# EAGLE design 20190608_ORIGAMI_V2-H-08slot-fixed (EAGLE 9.4.2)
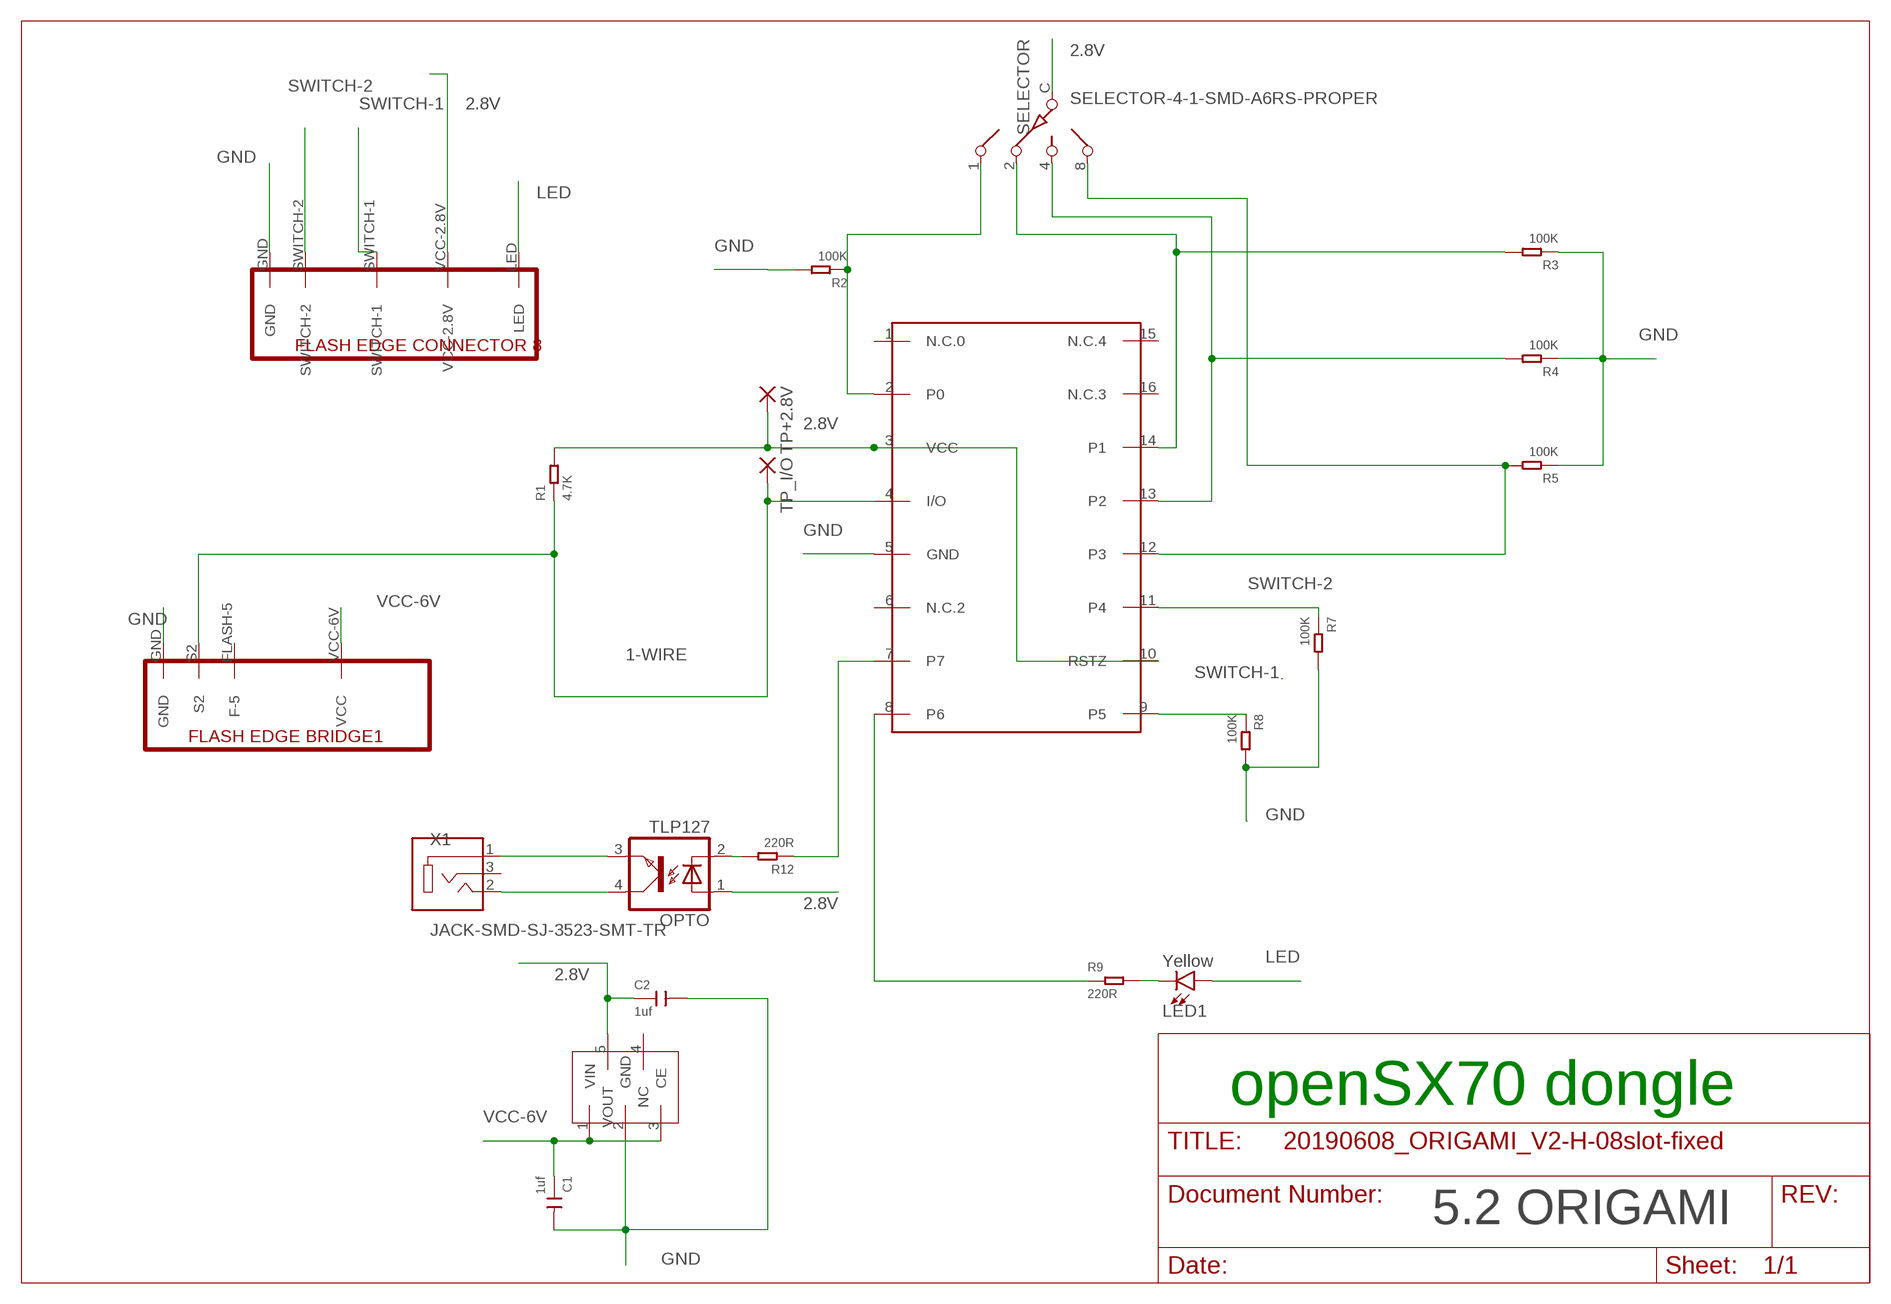
[diagram p0: schematic, sheet 1]

## Parts
C1  1uf  CERAMIC-1UF-25V-10%-X7R(0603)  [C0603]
C2  1uf  CERAMIC-1UF-25V-10%-X7R(0603)  [C0603]
DS2408  DS2408  [SO16]
LED1  Yellow  LED-YELLOWLILYPAD  [LED-1206]
OPTO  TLP127  [SO-4]
R1  4.7K  SMD-RES-4.7K-5%-1/10W(0603)  [R0603]
R2  100K  SMD-RES-100K-1%-1/10W(0603)  [R0603]
R3  100K  SMD-RES-100K-1%-1/10W(0603)  [R0603]
R4  100K  SMD-RES-100K-1%-1/10W(0603)  [R0603]
R5  100K  SMD-RES-100K-1%-1/10W(0603)  [R0603]
R7  100K  SMD-RES-100K-1%-1/10W(0603)  [R0603]
R8  100K  SMD-RES-100K-1%-1/10W(0603)  [R0603]
R9  220R  SMD-RES-220R-5%-1/10W(0603)  [R0603]
R12  220R  SMD-RES-220R-5%-1/10W(0603)  [R0603]
REG  NCP4688  [SOT-23-5]
SELECTOR  SELECTOR-4-1-SMD-A6RS-PROPER  [A6RS-161RS]
TP+2.8V  SMD2  [SMD1,27-2,54]
TP_I/O  SMD2  [SMD1,27-2,54]
U$1  FLASH-BRIDGE-SW1-SW2-LED  [FLASH-8-BRIDGE-SW1-SW2-LED]
U$2  FLASH-BRIDGE1  [FLASH-8-BRIDGE1]
X1  JACK-SMD-SJ-3523-SMT-TR  [CUI_SJ-3523-SMT-TR]

## Nets
1-WIRE: DS2408.4(I/O) R1.1 TP_I/O.1(P) U$2.S2
2.8V: C2.1 DS2408.3(VCC) DS2408.10(RSTZ) OPTO.1(A) R1.2 REG.5(VOUT) SELECTOR.C TP+2.8V.1(P) U$1.VCC-2.8V
GND: C1.2 C2.2 DS2408.5(GND) R2.2 R3.1 R4.1 R5.1 R7.2 R8.2 REG.2(GND) U$1.GND U$2.GND
LED: LED1.A U$1.LED
N$1: OPTO.3(EMIT) X1.1
N$2: LED1.C R9.2
N$3: DS2408.2(P0) R2.1 SELECTOR.1
N$4: DS2408.14(P1) R3.2 SELECTOR.2
N$5: DS2408.13(P2) R4.2 SELECTOR.4
N$6: OPTO.4(COL) X1.2
N$7: DS2408.8(P6) R9.1
N$10: OPTO.2(C) R12.2
N$11: DS2408.7 R12.1
N$13: DS2408.12(P3) R5.2 SELECTOR.8
SWITCH-1: DS2408.9(P5) R8.1 U$1.SWITCH-1
SWITCH-2: DS2408.11(P4) R7.1 U$1.SWITCH-2
VCC-6V: C1.1 REG.1(VIN) REG.3(CE) U$2.VCC-6V(VCC)
Unconnected: DS2408.1(N.C.0) DS2408.6(N.C.2) DS2408.15(N.C.4) DS2408.16(N.C.3) REG.4(NC) U$2.FLASH-5(F-5) X1.3

## Notes on the sheet
- openSX70 dongle
- 5.2 ORIGAMI

## Library data of the parts
C1 C2 = Seeed-Capacitor:CERAMIC-1UF-25V-10%-X7R(0603): 302010139; MPN: CC0603KRX7R8BB105
DS2408 = _openSX70:DS2408
LED1 = SparkFun-LED:LED-YELLOW: Yellow SMD LED Used in manufacturing several products at SparkFun. Packages: 0603 - SMD 0603 package[Product Link] <http://www.kingbrightusa.com/product.asp?catalog_name=LED&product_id=APT1608SYCK> 0603 -SMART - SMART SMD 0603 package (more efficient/more expensive) [Product Link] <http://www.osram-os.com/osram_os/en/products/product-catalog/led-light-emitting-diodes/smartled-0603/ly-l29k/index.jsp> LilyPad - SMD1206 package[Product Datasheet] <https://www.sparkfun.com/datasheets/DevTools/LilyPad/Q150YUS4.pdf> SparkFun Products: Blynk Board <https://www.sparkfun.com/products/13794> IOIO-OTG <https://www.sparkfun.com/products/13613> XBee Explorer Serial <https://www.sparkfun.com/products/13225>; PROD_ID: DIO-09909
OPTO = _openSX70:TLP127
R1 = Seeed-Resistor:SMD-RES-4.7K-5%-1/10W(0603): 301010290; MPN: RC0603JR-074K7L
R2-R5 R7 R8 = Seeed-Resistor:SMD-RES-100K-1%-1/10W(0603): 301010196; MPN: RC0603FR-07100KL
R9 R12 = Seeed-Resistor:SMD-RES-220R-5%-1/10W(0603): 301010163; MPN: RC0603JR-07220RL
REG = openSX70:NCP4688
SELECTOR = _openSX70:SELECTOR-4-1-SMD-A6RS-PROPER
TP+2.8V TP_I/O = wirepad:SMD2: SMD PAD
U$1 = _openSX70:FLASH-BRIDGE-SW1-SW2-LED
U$2 = _openSX70:FLASH-BRIDGE1
X1 = _openSX70:JACK-SMD-SJ-3523-SMT-TR: Audio Jack Connector 3.5 mm Low Profile Surface Mount Stereo Jack, 3 Pin Right-Angle; AVAILABILITY: Unavailable; CUI_PURCHASE_URL: https://www.cui.com/product/interconnect/audio-connectors/3.5-mm-jacks/sj-352x-smt-series?utm_source=snapeda.com&utm_medium=referral&utm_campaign=snapedaBOM; DESCRIPTION: SJ Series 3.5 mm 12 V SMT Right Angle Stereo Audio Jack; MF: CUI Inc.; MP: SJ-3523-SMT-TR; PACKAGE: LGA-10 STMicroelectronics; PRICE: None

## Net classes
0 GND: width 0.305 mm
1 VCC: width 0.254 mm
2 2.8V: width 0.254 mm

## Board
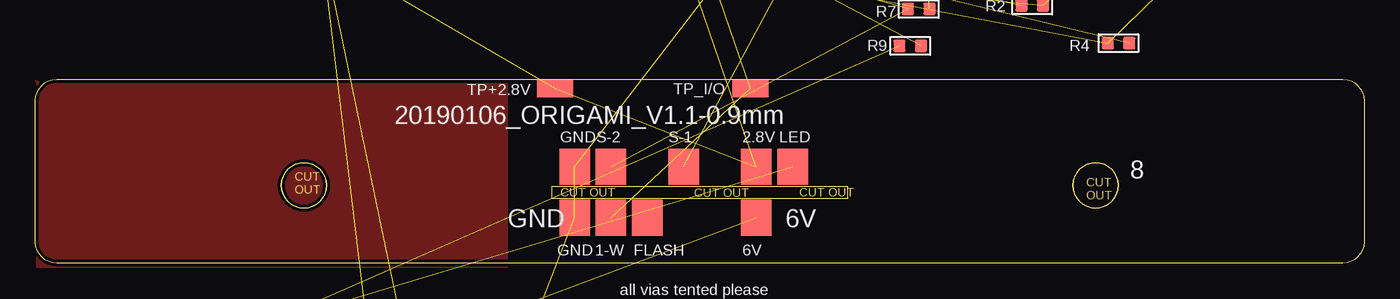
[diagram p1: board, top side]
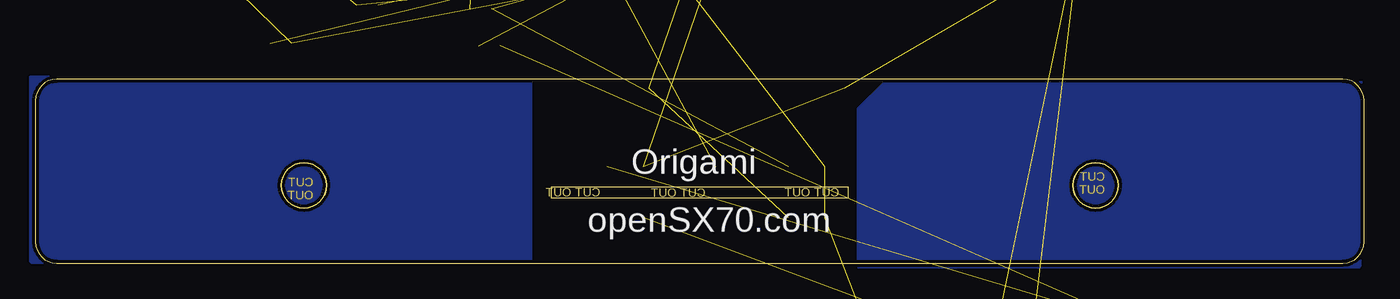
[diagram p2: board, bottom side, seen from below]

Size 94 x 13 mm. Coordinates in mm from the lower left corner, seen from the top.
Outline: 75,7.11 75.32,7.07 75.62,6.98 75.9,6.83 76.14,6.64
Outline: 76.14,6.64 76.33,6.4 76.48,6.13 76.57,5.82 76.61,5.5
Outline: 76.61,5.5 76.57,5.18 76.48,4.88 76.33,4.6 76.14,4.37
Outline: 76.14,4.37 75.9,4.17 75.62,4.02 75.32,3.93 75,3.9
Outline: 75,3.9 74.68,3.93 74.38,4.02 74.1,4.17 73.87,4.37
Outline: 73.87,4.37 73.67,4.6 73.52,4.88 73.43,5.18 73.4,5.5
Outline: 73.4,5.5 73.43,5.82 73.52,6.13 73.67,6.4 73.87,6.64
Outline: 73.87,6.64 74.1,6.83 74.38,6.98 74.68,7.07 75,7.11
Outline: 19,7.11 19.32,7.07 19.62,6.98 19.9,6.83 20.14,6.64
Outline: 20.14,6.64 20.33,6.4 20.48,6.13 20.57,5.82 20.61,5.5
Outline: 20.61,5.5 20.57,5.18 20.48,4.88 20.33,4.6 20.14,4.37
Outline: 20.14,4.37 19.9,4.17 19.62,4.02 19.32,3.93 19,3.9
Outline: 19,3.9 18.68,3.93 18.38,4.02 18.1,4.17 17.87,4.37
Outline: 17.87,4.37 17.67,4.6 17.52,4.88 17.43,5.18 17.4,5.5
Outline: 17.4,5.5 17.43,5.82 17.52,6.13 17.67,6.4 17.87,6.64
Outline: 17.87,6.64 18.1,6.83 18.38,6.98 18.68,7.07 19,7.11
Outline: 75,7.11 74.69,7.07 74.39,6.98 74.11,6.83 73.87,6.64
Outline: 73.87,6.64 73.67,6.39 73.52,6.11 73.43,5.81 73.4,5.5
Outline: 73.4,5.5 73.43,5.19 73.52,4.89 73.67,4.61 73.87,4.37
Outline: 73.87,4.37 74.11,4.17 74.39,4.02 74.69,3.93 75,3.9
Outline: 75,3.9 75.31,3.93 75.61,4.02 75.89,4.17 76.14,4.37
Outline: 76.14,4.37 76.33,4.61 76.48,4.89 76.57,5.19 76.61,5.5
Outline: 76.61,5.5 76.57,5.81 76.48,6.11 76.33,6.39 76.14,6.64
Outline: 76.14,6.64 75.89,6.83 75.61,6.98 75.31,7.07 75,7.11
Outline: 19,7.11 18.69,7.07 18.39,6.98 18.11,6.83 17.87,6.64
Outline: 17.87,6.64 17.67,6.39 17.52,6.11 17.43,5.81 17.4,5.5
Outline: 17.4,5.5 17.43,5.19 17.52,4.89 17.67,4.61 17.87,4.37
Outline: 17.87,4.37 18.11,4.17 18.39,4.02 18.69,3.93 19,3.9
Outline: 19,3.9 19.31,3.93 19.61,4.02 19.89,4.17 20.14,4.37
Outline: 20.14,4.37 20.33,4.61 20.48,4.89 20.57,5.19 20.61,5.5
Outline: 20.61,5.5 20.57,5.81 20.48,6.11 20.33,6.39 20.14,6.64
Outline: 20.14,6.64 19.89,6.83 19.61,6.98 19.31,7.07 19,7.11
Outline: 1.51,13 92.49,13 92.8,12.97 93.08,12.88 93.33,12.74 93.56,12.56 93.74,12.33 93.88,12.08 93.97,11.8 94,11.49 94,1.51 93.97,1.2 93.88,0.92 93.74,0.67 93.56,0.44 93.33,0.26 93.08,0.12 92.8,0.03 92.49,0 1.51,0 1.2,0.03 0.92,0.12 0.67,0.26 0.44,0.44 0.26,0.67 0.12,0.92 0.03,1.2 0,1.51 0,11.49 0.03,11.8 0.12,12.08 0.26,12.33 0.44,12.56 0.67,12.74 0.92,12.88 1.2,12.97 1.51,13
Outline: 36.5,4.61 57.5,4.61 57.5,5.41 36.5,5.41 36.5,4.61
Copper layers (1*16): Top 0.035mm / dielectric 1.5mm / Bottom 0.035mm
Design rules "SeeedStudio_2layer_DRU_no_angle_20140221": minimum track width 6mil, minimum drill 12mil, track to track 6mil, track to pad 6mil, pad to pad 6mil, via to via 6mil, smd to smd 0mil, copper to edge 10mil, drill to drill 10mil, minimum pad ring 10mil, minimum via ring 6mil, stop-mask expansion 2mil, vias tented up to drill 100mil, thermal gap 10mil

### Footprints (pad centres in the part's own frame; a part is rotated, then mirrored left to right if it is on the bottom)
C0603 = smd 0.889 x 0.889: 1 0,0.762; 2 0,-0.762
SO16 = smd 0.66 x 2.032: 1 -4.445,-3.073; 2 -3.175,-3.073; 3 -1.905,-3.073; 4 -0.635,-3.073; 5 0.635,-3.073; 6 1.905,-3.073; 7 3.175,-3.073; 8 4.445,-3.073; 9 4.445,3.073; 10 3.175,3.073; 11 1.905,3.073; 12 0.635,3.073; 13 -0.635,3.073; 14 -1.905,3.073; 15 -3.175,3.073; 16 -4.445,3.073
LED-1206 = smd 1.2 x 1.4: A -1.5,0; C 1.5,0
SO-4 = smd 1 x 0.6: 1 -3.24,0.635; 2 -3.24,-1.905; 3 3.24,-1.905; 4 3.24,0.635
R0603 = smd 0.889 x 0.889: 1 0,0.762; 2 0,-0.762
SOT-23-5 = smd 0.69 x 1.2: 1 -0.95,-1.3; 2 0,-1.3; 3 0.95,-1.3; 4 0.95,1.3; 5 -0.95,1.3
A6RS-161RS = smd 1 x 2.7: 1 8.89,-1.397; 2 6.35,-1.397; 4 3.81,-1.397; 8 1.27,-1.397; C 6.35,11.303
SMD1,27-2,54 = smd 1.27 x 2.54: 1 0,0
FLASH-8-BRIDGE-SW1-SW2-LED = smd 2.159 x 2.54: GND -9,7.5; LED 6.42,7.5; SWITCH-1 -1.29,7.5; SWITCH-2 -6.43,7.5; VCC-2.8V 3.85,7.5
FLASH-8-BRIDGE1 = smd 2.159 x 2.54: FLASH-5 -3.86,7.5; GND -9,7.5; S2 -6.43,7.5; VCC-6V 3.85,7.5
CUI_SJ-3523-SMT-TR = smd 2.2 x 2.8: 1 -1.1,-3.7; 3 0.9,3.7 | smd 2.8 x 2.8: 2 8.3,-3.7 | hole 1.7: 0,0; 7,0

### Placement (x,y rotation side)
C1  20.28,-7.99 270 top  (outside the outline)
C2  32.48,-9.53 90 top  (outside the outline)
DS2408  33.14,24.92 90 top  (outside the outline)
LED1  7.95,-7.29 0 top  (outside the outline)
OPTO  17.22,22.53 180 top  (outside the outline)
R1  39.99,40.94 270 top  (outside the outline)
R2  70.52,18.23 270 top  (outside the outline)
R3  20.8,23.91 90 top  (outside the outline)
R4  76.62,15.55 270 top
R5  61.59,36.34 90 top  (outside the outline)
R7  62.49,17.99 90 top  (outside the outline)
R8  61.49,34.48 90 top  (outside the outline)
R9  61.89,15.37 270 top
R12  22.2,25.4 270 top  (outside the outline)
REG  25.17,-7.9 270 top  (outside the outline)
SELECTOR  85.49,22.49 90 top  (outside the outline)
TP+2.8V  36.76,12.37 90 top
TP_I/O  50.6,12.37 90 top
U$1  47.14,-0.69 0 top
U$2  47.14,-4.29 0 top
X1  15.2,32.71 0 top  (outside the outline)

### Tracks (layer width: path | path; a pad name or v marks a point on that pad's centre or on a via)
1-WIRE  (3 unrouted)
2.8V  (8 unrouted)
GND  (11 unrouted)
  pour Bottom: 0.14,12.81 33.94,12.81 35.84,10.91 35.84,-0.29 0.34,-0.29 0.24,-0.19 0.24,12.71
  pour Bottom: 58.94,12.91 58.94,0.01 94.24,0.01 94.34,0.11 94.34,13.21 59.24,13.21
  pour Top: 0.24,12.81 33.34,12.81 33.34,-0.29 0.14,-0.29 0.14,12.81 0.04,12.91
LED  (1 unrouted)
N$1  (1 unrouted)
N$2  (1 unrouted)
N$3  (2 unrouted)
N$4  (2 unrouted)
N$5  (2 unrouted)
N$6  (1 unrouted)
N$7  (1 unrouted)
N$10  (1 unrouted)
N$11  (1 unrouted)
N$13  (2 unrouted)
SWITCH-1  (2 unrouted)
SWITCH-2  (2 unrouted)
VCC-6V  (3 unrouted)

### Text on the board
Dimension: CUT / OUT | CUT OUT | CUT OUT | CUT OUT | CUT / OUT
tPlace: 20190106_ORIGAMI_V1.1-0.9mm
tNames: C | 0 | 4 | GND | S-2 | S-1 | 2.8V | LED | 8 | GND | 6V | GND | 1-W | FLASH | 6V | all vias tented please | A
bNames: Origami | openSX70.com